# Altium project MK2_PD.PrjPcb
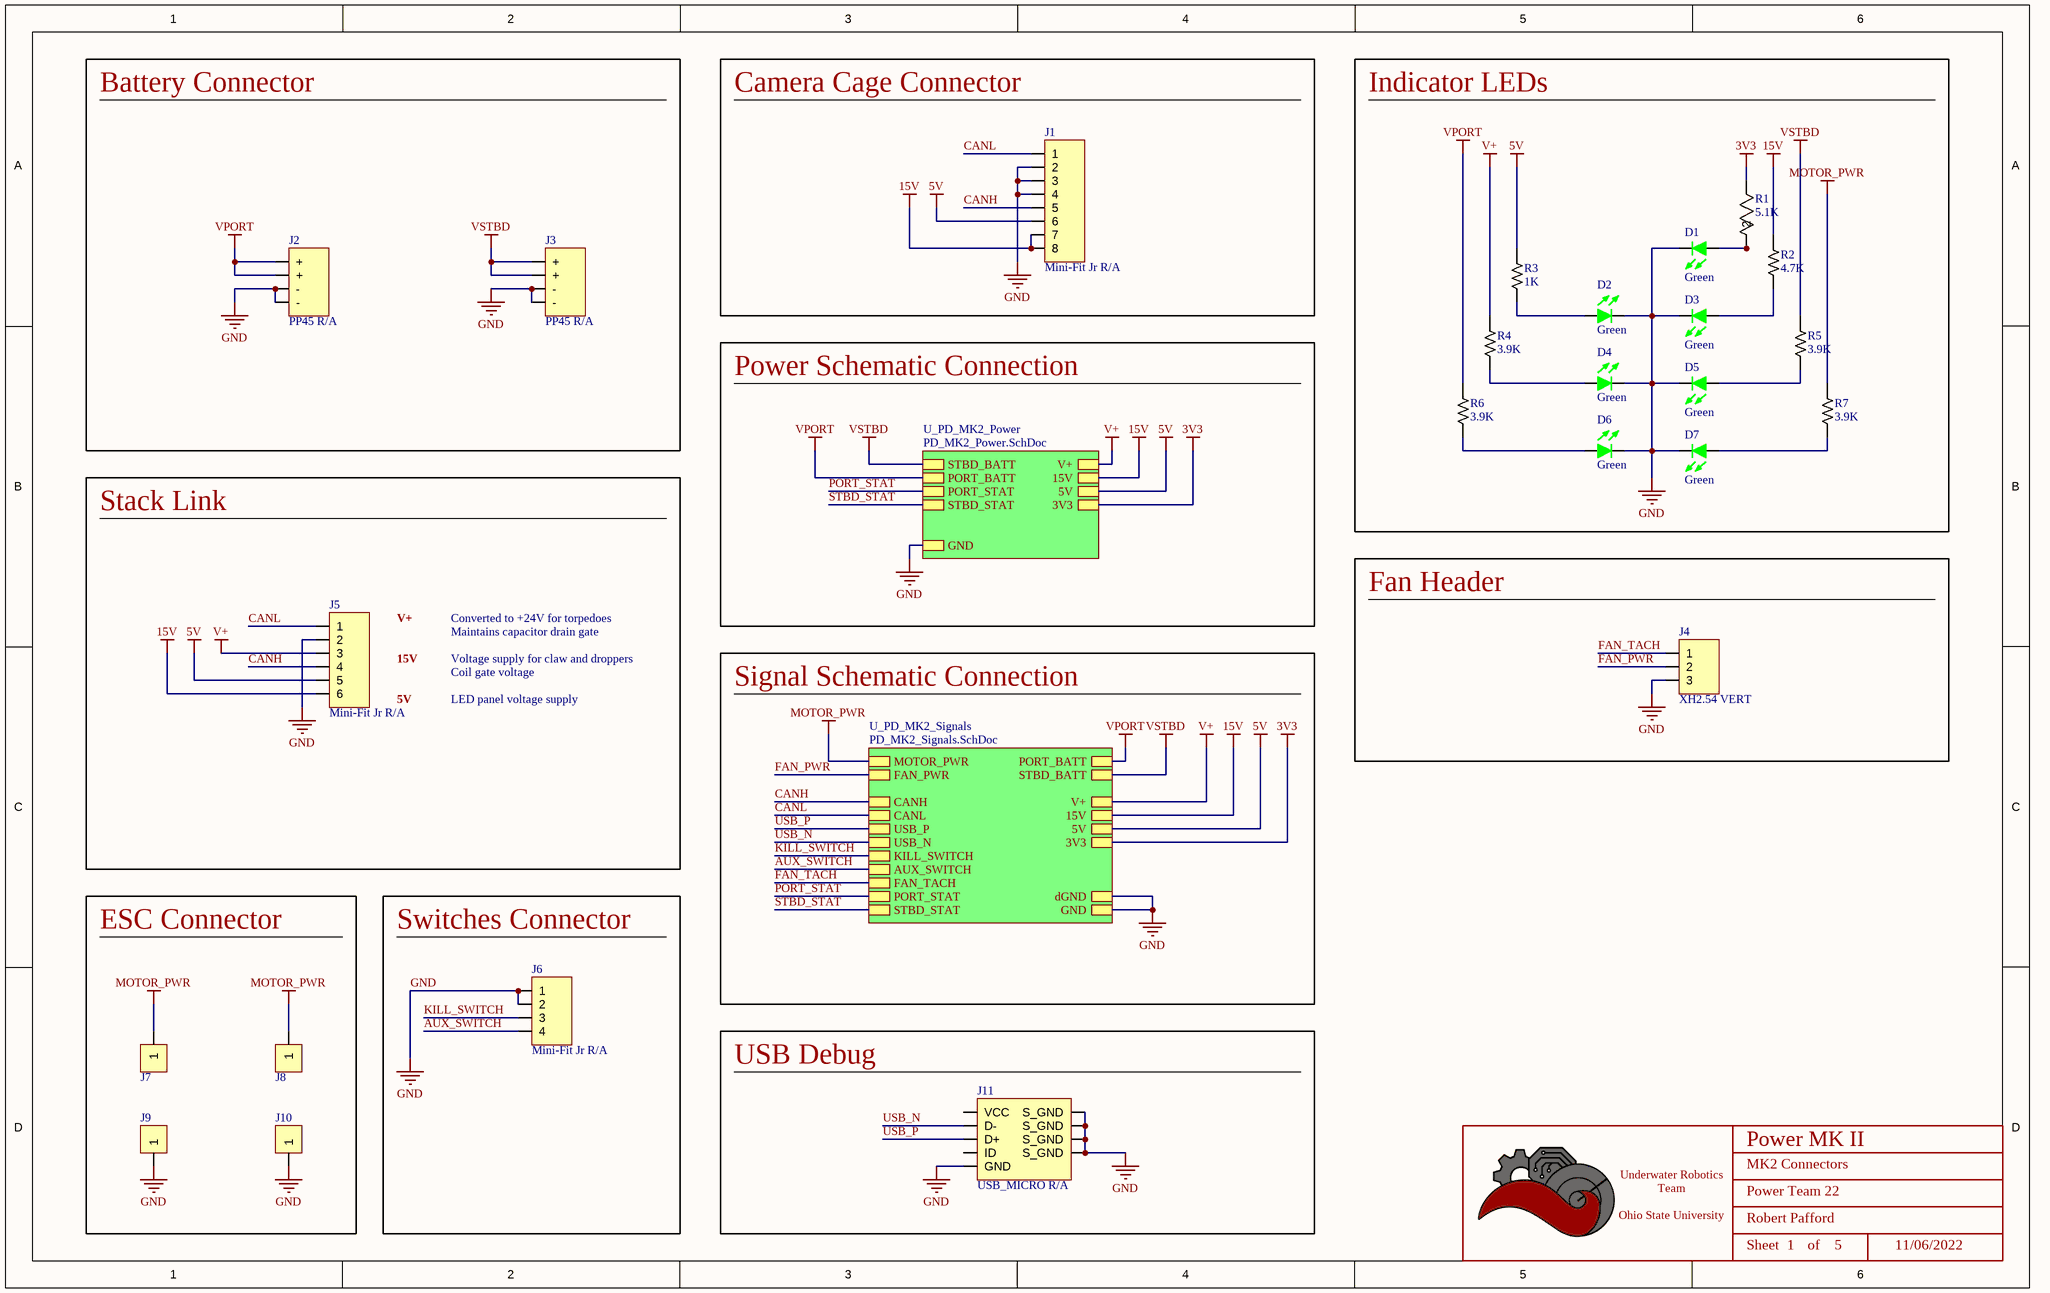
[diagram p0: PD_MK2_Connectors.SchDoc]
BoardRevision: 1.1; DateOfDesignReview: 01/08/2022; ProjectTitle: Power MK II; TeamLead: Robert Pafford
3 sheets, 91 parts. Net scope: strictly hierarchical (ports join the sheet entries above them; power ports are local).
Board file: MK2_PD.PcbDoc
Sheets:
  PD_MK2_Connectors.SchDoc
    U_PD_MK2_Power = PD_MK2_Power.SchDoc
    U_PD_MK2_Signals = PD_MK2_Signals.SchDoc

## Sheet PD_MK2_Connectors.SchDoc: MK2 Connectors
size B; Date: 11/06/2022; Author: Power Team 22; Organization: ORGANIZATION; Address1: ADDRESS 1; Address2: ADDRESS 2; Address3: ADDRESS 3; Address4: ADDRESS 4; DocumentNumber: 1; Revision: -; SheetNumber: 1; SheetTotal: 5; ENG_APP_DATE: --/--/--; DSN_APP_DATE: --/--/--; CHK_APP_DATE: --/--/--

### Parts
(Parts that share a designator on the sheet are numbered #1, #2 ... from top to bottom, then left to right.)
*#1  Title_Block  [LOGO]  (value not drawn)  (graphical)
D1  Color: Green  [LED_0603]  (hidden comment: IN-S63AT5G)
D2  Color: Green  [LED_0603]  (hidden comment: IN-S63AT5G)
D3  Color: Green  [LED_0603]  (hidden comment: IN-S63AT5G)
D4  Color: Green  [LED_0603]  (hidden comment: IN-S63AT5G)
D5  Color: Green  [LED_0603]  (hidden comment: IN-S63AT5G)
D6  Color: Green  [LED_0603]  (hidden comment: IN-S63AT5G)
D7  Color: Green  [LED_0603]  (hidden comment: IN-S63AT5G)
J1  Mini-Fit Jr R/A  [CONN_MOLEX_MINIFIT JR_8 POS_R/A]
J2  PP45 R/A  [CONN_ANDERSON_PP45_4 POS_R/A]
J3  PP45 R/A  [CONN_ANDERSON_PP45_4 POS_R/A]
J4  XH2.54 VERT  [CONN_JST_XH254_3POS_VERT]
J5  Mini-Fit Jr R/A  [CONN_MOLEX_MINIFIT JR_6 POS_R/A]
J6  Mini-Fit Jr R/A  [CONN_MOLEX_MINIFIT JR_4 POS_R/A]
J7  Redcube M4 Term 85A  [Redcube M4 Term 85A]  (value not drawn)
J8  Redcube M4 Term 85A  [Redcube M4 Term 85A]  (value not drawn)
J9  Redcube M4 Term 85A  [Redcube M4 Term 85A]  (value not drawn)
J10  Redcube M4 Term 85A  [Redcube M4 Term 85A]  (value not drawn)
J11  USB_MICRO R/A  [CONN_MINIUSB]
R1  5.1K  [RC0603N_PAN]
R2  Value  (Ohms): 4.7K  [RESISTOR_0603]  (hidden comment: 4.7k Ohm 5% 1/10W)
R3  Value  (Ohms): 1K  [RESISTOR_0603]  (hidden comment: 1k Ohm 5% 1/8W)
R4  Value  (Ohms): 3.9K  [RESISTOR_0603]  (hidden comment: 3.9k Ohm 5% 1/10W)
R5  Value  (Ohms): 3.9K  [RESISTOR_0603]  (hidden comment: 3.9k Ohm 5% 1/10W)
R6  Value  (Ohms): 3.9K  [RESISTOR_0603]  (hidden comment: 3.9k Ohm 5% 1/10W)
R7  Value  (Ohms): 3.9K  [RESISTOR_0603]  (hidden comment: 3.9k Ohm 5% 1/10W)

### Blocks framed on the sheet
Battery Connector: J2 J3
Camera Cage Connector: J1
Indicator LEDs: D1-D7 R1-R7
Stack Link: J5
Fan Header: J4
ESC Connector: J7-J10
Switches Connector: J6
USB Debug: J11

### Sub-sheets
U_PD_MK2_Power = PD_MK2_Power.SchDoc: STBD_BATT, PORT_BATT, GND, V+, 15V, 5V, 3V3, PORT_STAT, STBD_STAT
U_PD_MK2_Signals = PD_MK2_Signals.SchDoc: CANH, CANL, KILL_SWITCH, MOTOR_PWR, STBD_BATT, PORT_BATT, USB_P, USB_N, GND, V+, 15V, 5V, 3V3, dGND, FAN_PWR, FAN_TACH, AUX_SWITCH, PORT_STAT, STBD_STAT

### Nets
3V3: R1.1 ; sheet U_PD_MK2_Power/3V3, sheet U_PD_MK2_Signals/3V3
5V: J1.6 J5.5 R3.1 ; sheet U_PD_MK2_Power/5V, sheet U_PD_MK2_Signals/5V
15V: J1.7 J1.8 J5.6 R2.1 ; sheet U_PD_MK2_Power/15V, sheet U_PD_MK2_Signals/15V
GND: D1.2 D2.2 D3.2 D4.2 D5.2 D6.2 D7.2 J1.2 J1.3 J1.4 J2.3(-) J2.4(-) J3.3(-) J3.4(-) J4.3 J5.2 J6.1 J6.2 J9.1 J10.1 J11.5(GND) J11.6(S_GND) J11.7(S_GND) J11.8(S_GND) J11.9(S_GND) ; sheet U_PD_MK2_Power/GND, sheet U_PD_MK2_Signals/GND, sheet U_PD_MK2_Signals/dGND
MOTOR_PWR: J7.1 J8.1 R7.1 ; sheet U_PD_MK2_Signals/MOTOR_PWR
V+: J5.3 R4.1 ; sheet U_PD_MK2_Power/V+, sheet U_PD_MK2_Signals/V+
VPORT: J2.1(+) J2.2(+) R6.1 ; sheet U_PD_MK2_Power/PORT_BATT, sheet U_PD_MK2_Signals/PORT_BATT
VSTBD: J3.1(+) J3.2(+) R5.1 ; sheet U_PD_MK2_Power/STBD_BATT, sheet U_PD_MK2_Signals/STBD_BATT
AUX_SWITCH: J6.4 ; sheet U_PD_MK2_Signals/AUX_SWITCH
CANH: J1.5 J5.4 ; sheet U_PD_MK2_Signals/CANH
CANL: J1.1 J5.1 ; sheet U_PD_MK2_Signals/CANL
FAN_PWR: J4.2 ; sheet U_PD_MK2_Signals/FAN_PWR
FAN_TACH: J4.1 ; sheet U_PD_MK2_Signals/FAN_TACH
KILL_SWITCH: J6.3 ; sheet U_PD_MK2_Signals/KILL_SWITCH
PORT_STAT: sheet U_PD_MK2_Power/PORT_STAT, sheet U_PD_MK2_Signals/PORT_STAT
STBD_STAT: sheet U_PD_MK2_Power/STBD_STAT, sheet U_PD_MK2_Signals/STBD_STAT
USB_N: J11.2(D-) ; sheet U_PD_MK2_Signals/USB_N
USB_P: J11.3(D+) ; sheet U_PD_MK2_Signals/USB_P
NetD1_1: D1.1 R1.2
NetD2_1: D2.1 R3.2
NetD3_1: D3.1 R2.2
NetD4_1: D4.1 R4.2
NetD5_1: D5.1 R5.2
NetD6_1: D6.1 R6.2
NetD7_1: D7.1 R7.2

Not connected (* = marked no-connect by the designer): J11 1(VCC) 4(ID)

### Notes on the sheet
- Power Schematic Connection
- V+
- Converted to +24V for torpedoes
- Maintains capacitor drain gate
- 15V
- 5V
- Voltage supply for claw and droppers
- Coil gate voltage
- LED panel voltage supply
- Signal Schematic Connection
- DWG. NO.
- REV.
- SHT.
- THIS DOCUMENT AND THE DATA DISCLOSED HEREIN OR HEREWITH IS THE PROPERTY OF ALTIUM LIMITED AND MAY BE FREELY DISTRIBUTED IN WHOLE. NO RIGHTS ARE RESERVED OR EXPRESS OR IMPLIED WARANTEE GIVEN.
- REVISION
- DESCRIPTION
- DATE
- APPROVED
- ENG:
- APPROVALS
- PROJECT
- DSN:
- CHK:
- REFERENCE DOCUMENTS
- PROJECT REVISION:
- TITLE
- DOCUMENT REVISION:
- DESIGN ITEM:
- BOM:
- FAB DWG:
- PCB DWG:
- ASSY DWG:
- SCALE:
- SIZE
- B
- CAGE CODE
- FILE NAME
- DWG NO.
- SHEET
- OF
- REV
- (in symbol Title_Block) Underwater Robotics Team / Ohio State University; Sheet; of

### Library data of the parts
*#1 = Title_Block: UWRT Schematic Title Block Template / Created June 2021, Dylan Trainor
D1-D7 = LED_Green_0603_3V: LED Green Vf= 3V If = 0.005A / IN-S63AT5G; Made By: Robert Pafford; Forward Current: 5mA; ComponentLink1Description: Datasheet; ComponentLink1URL: https://www.we-online.de/katalog/datasheet/150060GS75000.pdf; Forward Voltage: 3V; Package: 0603; Supplier 1: Digi-Key; Supplier Part Number 1: 1830-1062-1-ND
J1 = CONN_MOLEX_MINIFIT JR_8POS_R/A: Molex Minifit Jr. 5569 / 8 Pos R/A Natural; Pitch: 4.2mm; Configuration: Right Angle; Current Per Pin: 13A; Number of Positions: 8; Manufacturer: Molex; Color: Natural; Created By: Flip B; ComponentLink1Description: Datasheet; ComponentLink1URL: https://www.molex.com/pdm_docs/ps/PS-5556-001.pdf; Series: Minifit Jr 5569; Supplier 1: Digi-Key; Supplier Part Number 1: WM1354-ND
J2 J3 = CONN_ANDERSON_2x2_R/A: Anderson PP45 / 4 Pos R/A Red/Black; Pitch: 7.9mm; Configuration: Right Angle; Current Per Pin: 45A; Number of Positions: 4; Manufacturer: Anderson; Color: Red/Black; Created By: Flip B; ComponentLink1Description: Datasheet; ComponentLink1URL: https://www.andersonpower.com/content/dam/app/ecommerce/product-pdfs/DS-PP1545.pdf; Series: PowerPole 45; Supplier 1: Digi-Key; Supplier Part Number 1: 2243-1337G1-ND; Supplier 2: Digi-Key; Supplier Part Number 2: 2243-1336G1-ND; Supplier 3: Digi-Key; Supplier Part Number 3: 2243-1327-BK-ND; Supplier 4: Digi-Key; Supplier Part Number 4: A102007-ND
J4 = CONN_JST_XH254_3POS_VERT: JST XH 2.54mm Pitch 3 Pos Vertical; Current Per Pin: 4A; Number of Positions: 3; NOTE: Do not use JST 2.5mm parts with this footprint. JST does not make 2.54mm pitch pins, rather only clones make this connector!; Manufacturer: JST; Pitch: 2.54mm; Configuration: Vertical; Color: White; Created By: Robert P; Series: XH 2.54; ComponentLink1Description: Purchase Link; ComponentLink1URL: https://www.amazon.com/460PCS-XH2-54-Connector-Terminal-Connectors/dp/B09DBGVX5C
J5 = CONN_MOLEX_MINIFIT JR_6POS_R/A: Molex Minifit Jr. 5569 / 6 Pos R/A Natural; Pitch: 4.2mm; Configuration: Right Angle; Current Per Pin: 13A; Number of Positions: 8; Manufacturer: Molex; Color: Natural; Created By: Flip B; ComponentLink1Description: Datasheet; ComponentLink1URL: https://www.molex.com/pdm_docs/ps/PS-5556-001.pdf; Series: Minifit Jr 5569; Supplier 1: Digi-Key; Supplier Part Number 1: WM1353-ND
J6 = CONN_MOLEX_MINIFIT JR_4POS_R/A: Molex Minifit Jr. 5569 / 4 Pos R/A Natural; Pitch: 4.2mm; Configuration: Right Angle; Current Per Pin: 13A; Number of Positions: 4; Supplier Part Number 1: WM13112-ND; Supplier 1: Digi-Key; Manufacturer: Molex; Color: Natural; Created By: Flip B; ComponentLink1Description: Datasheet; ComponentLink1URL: https://www.molex.com/pdm_docs/sd/026013115_sd.pdf; Series: Minifit Jr 5569
J11 = CONN_MICROUSB: Amphenol Micro USB-B / USB2.0 5 Pin Right Angle SMD; Pitch: 0.65mm; Current Per Pin: 1.8A; Number of Positions: 5; Manufacturer: Amphenol; Configuration: Right Angle; Color: Silver; Created By: Flip B; ComponentLink1Description: Datasheet; ComponentLink1URL: https://cdn.amphenol-icc.com/media/wysiwyg/files/documentation/datasheet/inputoutput/io_usb_micro.pdf?__cf_chl_jschl_tk__=05693735e19256298f6ef6ca2bb2e65c376a4f56-1625503833-0-Abitsb0-ufjOXJYs_S3J3r2iTn-nObalbmXUksF1VvO_h_WEmRdMlUD1I8-hmWSEVWzY1pirKnrPZWfgY3851qyBZe5ZvnNQePLGIzUgdEIQBVUyW36RsbYpDLEWxJ4horD-5gChFgobLYqwmG5aHl0E8lIn_twwPPrOxilK2gP0q9t_CNOs_u5fMqXvXUrlsOv8tIE2NRlu6NVP8qtkL2GjhlkeTUbDMF8WvvpPDTFOgvZ4Y16Ej8F8AhWos88mo5B1HssXozw0XrkJQIqERITUu6rqloz9kf4ZzhBHtDAt-IkiAFY_Ds9SW8FYKKTtINJVpHZQ6Gyu1FFM4Dc9MO0maE8_mmNcwlxqyRoRk_MPWW8VyByXWM5RSp52jteRKw7FeI9WIYvCbPAOy0Eyib-aseIQsnGbglBcUY6_2xp8GYaJM38H3dNvBPsSOfJBPndKedwKHllxjkucXn6xsN0sDXkpGN-cu8_2bDTJ0g-uUucKSCooYX-ApSDNGpkA_p9zv1SOAD8c0zaZVmtiBsN75QpVz2rzq9_BFxOywPvR; Series: 10118192; Supplier 1: Digi-Key; Supplier Part Number 1: 609-4613-1-ND
R1 = ERA-3AEB512V_2: 5.1 kOhms ±0.1% 0.1W, 1/10W Chip Resistor 0603 (1608 Metric) Automotive AEC-Q200 Thin Film; Mfr_Name: Panasonic; Copyright: Copyright (C) 2023 Ultra Librarian. All rights reserved.; Manufacturer_Part_Number: ERA-3AEB512V_2; RefDes: RefDes; Type: DEV
R2 = RESISTOR_4.7K_0603: RES 4.7k OHM 5% 1/10W 0603; Tolerance: +/- 5%; Made By: Robert Pafford; Wattage: 1/10W; Supplier: Digikey; Digikey Part Numer: CR0603-JW-104ELFTR-ND; Supplier 1: Digi-Key; Supplier Part Number 1: RMCF0603JT4K70CT-ND
R3 = RESISTOR_1K_0603: RES 1k OHM 5% 1/8W 0603; Tolerance: +/- 5%; Made By: Robert Pafford; ComponentLink1Description: Datasheet; ComponentLink1URL: https://www.bourns.com/docs/product-datasheets/CRxxxxx.pdf; Wattage: 1/8W; Supplier: Digikey; Digikey Part Numer: CR0603-JW-104ELFTR-ND; Supplier 1: Digi-Key; Supplier Part Number 1: 2019-RK73B1JTTD102JCT-ND
R4-R7 = RESISTOR_3.9K_0603: RES 3.9k OHM 1% 1/10W 0603; Tolerance: +/- 1%; Made By: Robert Pafford; Wattage: 1/10W; Supplier 1: Digi-Key; Supplier Part Number 1: P3.90KHCT-ND
J7-J10 = Redcube M4 Term 85A: Created By: Nahtan Ayer; Current Rating: 85 A; Screw Size: M4

## Sheet PD_MK2_Power.SchDoc: Power
size B; Date: 11/6/2022; Author: Power Team; Organization: ORGANIZATION; Address1: ADDRESS 1; Address2: ADDRESS 2; Address3: ADDRESS 3; Address4: ADDRESS 4; DocumentNumber: 3; Revision: -; SheetNumber: 3; SheetTotal: 5; ENG_APP_DATE: --/--/--; DSN_APP_DATE: --/--/--; CHK_APP_DATE: --/--/--
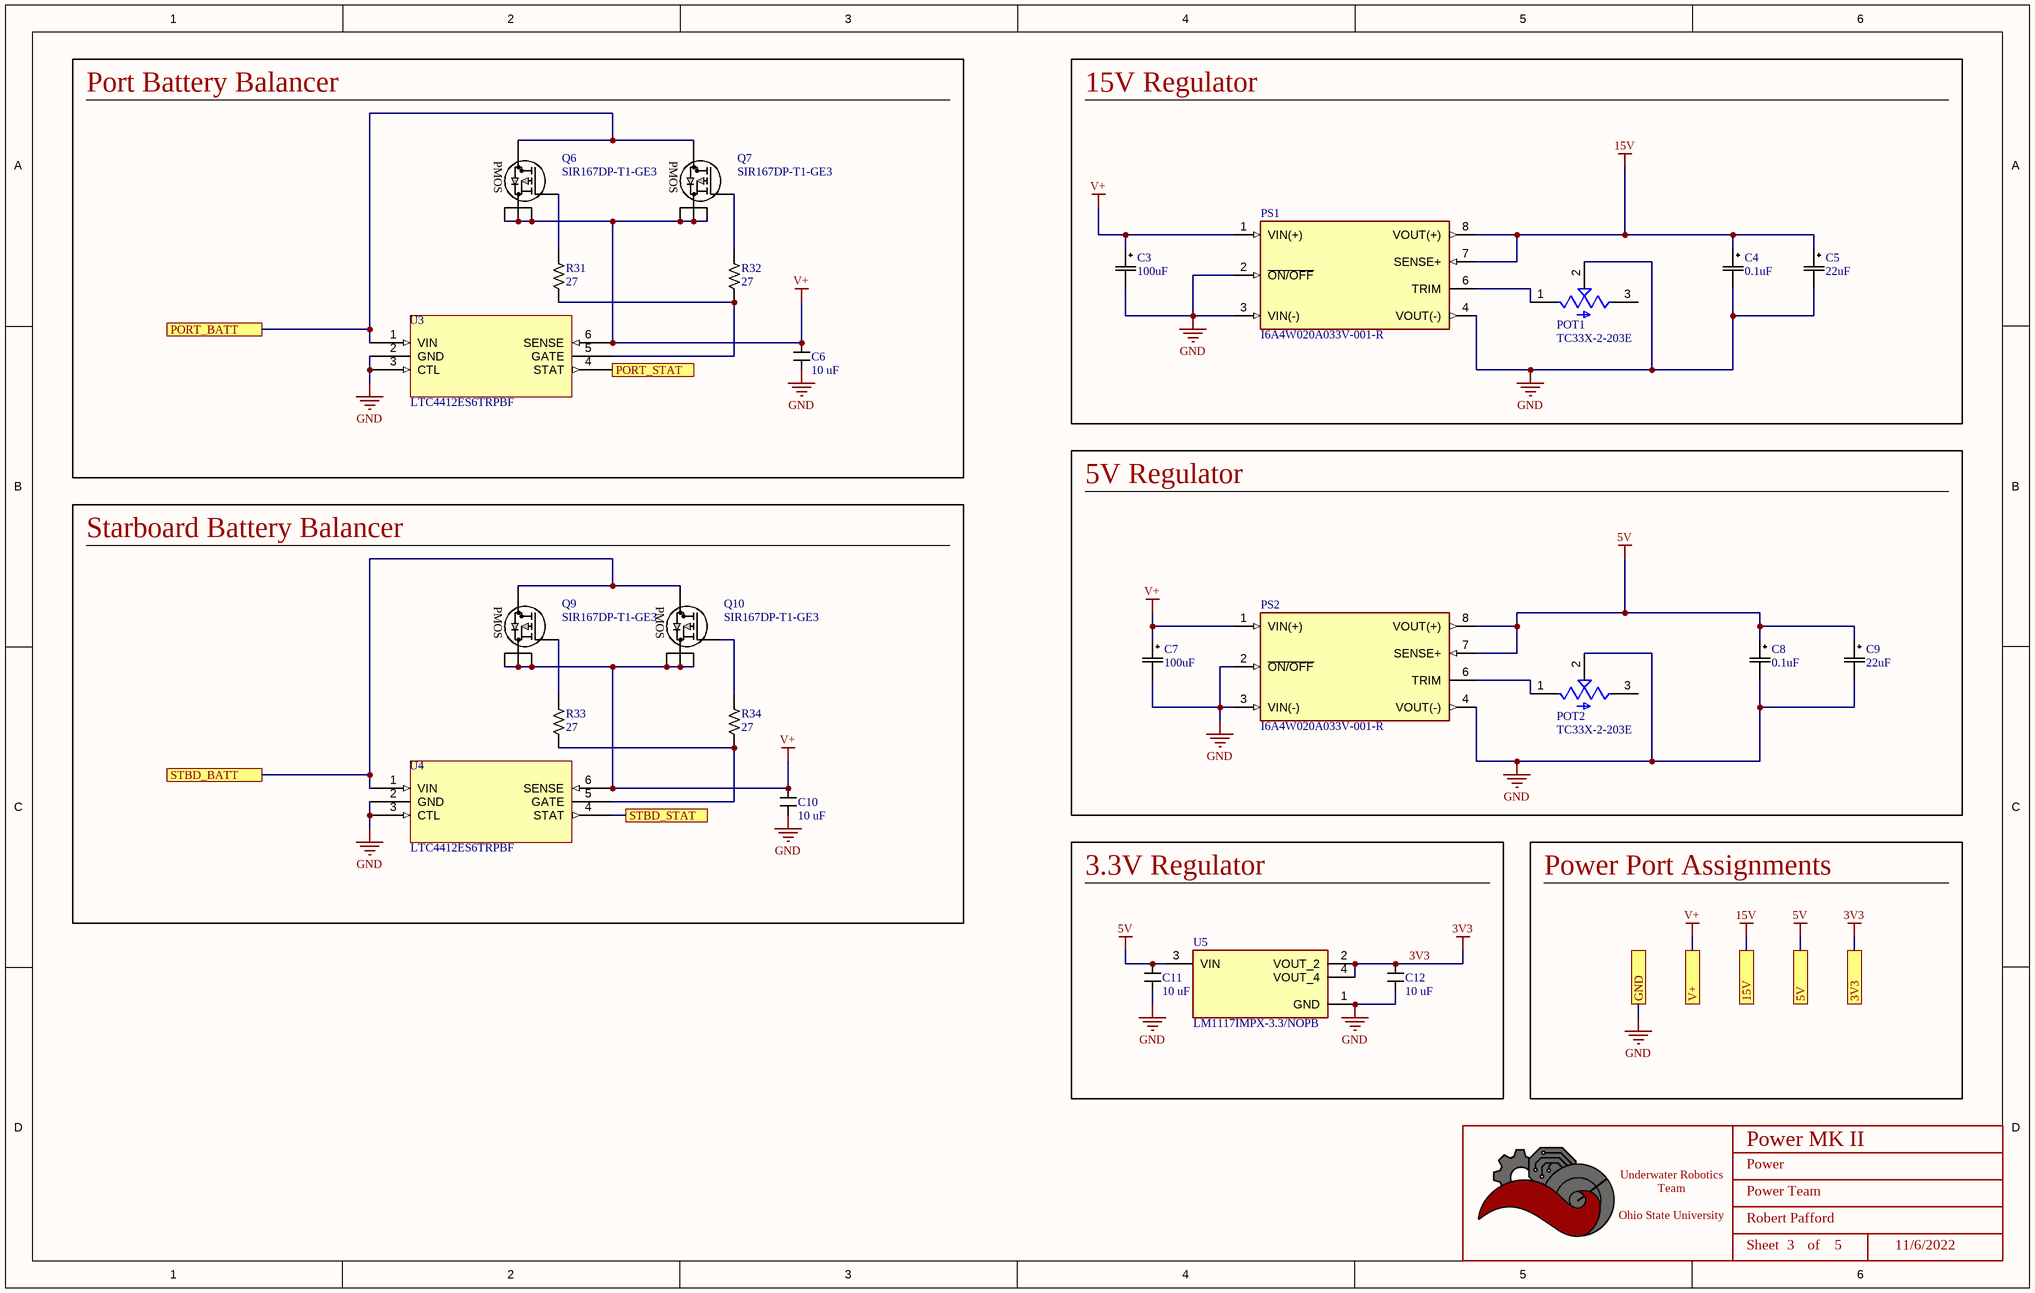
[diagram p1: PD_MK2_Power.SchDoc]

### Parts
(Parts that share a designator on the sheet are numbered #1, #2 ... from top to bottom, then left to right.)
*#2  Title_Block  [LOGO]  (value not drawn)  (graphical)
C3  value 100uF  [PCAP_8x5.4-ELECT_NCA]  (hidden comment: 100uF electrolytic 35 V)
C4  value 0.1uF  [U2-D_NCH]  (hidden comment: 0.1uF electrolytic 35 V)
C5  value 22uF  [PCAP_8x5.4-ELECT_NCA]  (hidden comment: 22uF electrolytic 35 V)
C6  Value (uF): 10 uF  [CAPACITOR_1206]  (hidden comment: 10uF Ceramic 25V)
C7  value 100uF  [PCAP_8x5.4-ELECT_NCA]  (hidden comment: 100uF electrolytic 35 V)
C8  value 0.1uF  [U2-D_NCH]  (hidden comment: 0.1uF electrolytic 35 V)
C9  value 22uF  [PCAP_8x5.4-ELECT_NCA]  (hidden comment: 22uF electrolytic 35 V)
C10  Value (uF): 10 uF  [CAPACITOR_1206]  (hidden comment: 10uF Ceramic 25V)
C11  Value (uF): 10 uF  [CAPACITOR_0603]  (hidden comment: 10uF Ceramic 6.3V)
C12  Value (uF): 10 uF  [CAPACITOR_0603]  (hidden comment: 10uF Ceramic 6.3V)
POT1  TC33X-2-203E  [TRIM_TC33X-2-203E]
POT2  TC33X-2-203E  [TRIM_TC33X-2-203E]
PS1  I6A4W020A033V-001-R  [CONV_I6A4W020A033V-001-R]
PS2  I6A4W020A033V-001-R  [CONV_I6A4W020A033V-001-R]
Q6  SIR167DP-T1-GE3  [MOSFET_7DP-T1-GE3_VIS]
Q7  SIR167DP-T1-GE3  [MOSFET_7DP-T1-GE3_VIS]
Q9  SIR167DP-T1-GE3  [MOSFET_7DP-T1-GE3_VIS]
Q10  SIR167DP-T1-GE3  [MOSFET_7DP-T1-GE3_VIS]
R31  Value  (Ohms): 27  [RESISTOR_0603]  (hidden comment: 27 Ohm 5% 1/8W)
R32  Value  (Ohms): 27  [RESISTOR_0603]  (hidden comment: 27 Ohm 5% 1/8W)
R33  Value  (Ohms): 27  [RESISTOR_0603]  (hidden comment: 27 Ohm 5% 1/8W)
R34  Value  (Ohms): 27  [RESISTOR_0603]  (hidden comment: 27 Ohm 5% 1/8W)
U3  LTC4412ES6TRPBF  [TSOT-23_S6]
U4  LTC4412ES6TRPBF  [TSOT-23_S6]
U5  LM1117IMPX-3.3/NOPB  [SOT-223-4]

### Blocks framed on the sheet
Port Battery Balancer: C6 Q6 Q7 R31 R32 U3
15V Regulator: C3-C5 POT1 PS1
5V Regulator: C7-C9 POT2 PS2
Starboard Battery Balancer: C10 Q9 Q10 R33 R34 U4
3.3V Regulator: C11 C12 U5

### Ports
3V3, 5V, 15V, GND, PORT_BATT, PORT_STAT, STBD_BATT, STBD_STAT, V+

### Nets
3V3: C12.1 U5.2(VOUT_2) U5.4(VOUT_4) ; port 3V3
5V: C8.1 C9.1 C11.1 PS2.7(SENSE+) PS2.8(VOUT(+)) U5.3(VIN) ; port 5V
15V: C4.1 C5.1 PS1.7(SENSE+) PS1.8(VOUT(+)) ; port 15V
GND: C3.2 C4.2 C5.2 C6.2 C7.2 C8.2 C9.2 C10.2 C11.2 C12.2 POT1.2(W) POT2.2(W) PS1.2(~{ON/OFF}) PS1.3(VIN(-)) PS1.4(VOUT(-)) PS2.2(~{ON/OFF}) PS2.3(VIN(-)) PS2.4(VOUT(-)) U3.2(GND) U3.3(CTL) U4.2(GND) U4.3(CTL) U5.1(GND) ; port GND
V+: C3.1 C6.1 C7.1 C10.1 PS1.1(VIN(+)) PS2.1(VIN(+)) Q6.1(S) Q6.2(S) Q6.3(S) Q7.1(S) Q7.2(S) Q7.3(S) Q9.1(S) Q9.2(S) Q9.3(S) Q10.1(S) Q10.2(S) Q10.3(S) U3.6(SENSE) U4.6(SENSE) ; port V+
VPORT: Q6.D Q7.D U3.1(VIN) ; port PORT_BATT
VSTBD: Q9.D Q10.D U4.1(VIN) ; port STBD_BATT
PORT_STAT: U3.4(STAT) ; port PORT_STAT
STBD_STAT: U4.4(STAT) ; port STBD_STAT
NetPOT1_1: POT1.1(CCW) PS1.6(TRIM)
NetPOT2_1: POT2.1(CCW) PS2.6(TRIM)
NetQ6_4: Q6.4(G) R31.1
NetQ7_4: Q7.4(G) R32.1
NetQ9_4: Q9.4(G) R33.1
NetQ10_4: Q10.4(G) R34.1
NetR31_2: R31.2 R32.2 U3.5(GATE)
NetR33_2: R33.2 R34.2 U4.5(GATE)

Not connected (* = marked no-connect by the designer): POT1 3(CW); POT2 3(CW)

### Notes on the sheet
- Power Port Assignments
- DWG. NO.
- REV.
- SHT.
- THIS DOCUMENT AND THE DATA DISCLOSED HEREIN OR HEREWITH IS THE PROPERTY OF ALTIUM LIMITED AND MAY BE FREELY DISTRIBUTED IN WHOLE. NO RIGHTS ARE RESERVED OR EXPRESS OR IMPLIED WARANTEE GIVEN.
- REVISION
- DESCRIPTION
- DATE
- APPROVED
- ENG:
- APPROVALS
- PROJECT
- DSN:
- CHK:
- REFERENCE DOCUMENTS
- PROJECT REVISION:
- TITLE
- DOCUMENT REVISION:
- DESIGN ITEM:
- BOM:
- FAB DWG:
- PCB DWG:
- ASSY DWG:
- SCALE:
- SIZE
- B
- CAGE CODE
- FILE NAME
- DWG NO.
- SHEET
- OF
- REV
- (in symbol SIR167DP-T1-GE3) PMOS
- (in symbol Title_Block) Underwater Robotics Team / Ohio State University; Sheet; of

### Library data of the parts
*#2 = Title_Block: as *#1 on sheet PD_MK2_Connectors
C3 C7 = CAP ALUM 100UF 20% 35V SMD: 100 µF 35 V Aluminum Electrolytic Capacitors Radial, Can - SMD 1000 Hrs; Mfr_Name: Nichicon; Manufacturer_Part_Number: UCB1V0R1MCL1GS; Type: DEV; Made by: Tyson Nguyen; Copyright: Copyright (C) 2022 Ultra Librarian. All rights reserved.; RefDes: RefDes; Supplier 1: Newark; Supplier Part Number 1: 85Y4753
C4 C8 = CAP ALUM 0.1UF 20% 35V SMD: 0.1 µF 35 V Aluminum Electrolytic Capacitors Radial, Can - SMD 7000 Hrs @ 105°C; Mfr_Name: Nichicon; Manufacturer_Part_Number: UCB1V0R1MCL1GS; Type: DEV; Made by: Tyson Nguyen; Copyright: Copyright (C) 2022 Ultra Librarian. All rights reserved.; RefDes: RefDes; Supplier 1: Digi-Key; Supplier Part Number 1: 493-9956-1-ND
C5 C9 = CAP ALUM 22UF 20% 35V SMD: 22 µF 35 V Aluminum Electrolytic Capacitors Radial, Can - SMD 1000 Hrs; Made by: Robert Pafford; Voltage: 35V; Supplier 1: Digi-Key; Supplier Part Number 1: PCE3952DKR-ND
C6 C10 = CAPACITOR_10uF_1206: Cap 10uF 25V +/-10% / Ceramic 1206; Made By: Robert Pafford; Tolerance: +/- 10%; Voltage: 25V; Supplier 1: Digi-Key; Supplier Part Number 1: 1276-1804-6-ND
C11 C12 = CAPACITOR_10uF_0603: Cap 10uF 6.3V +/-20% / Ceramic 0603; Made By: Flip B; ComponentLink1Description: Digikey; ComponentLink1URL: https://www.digikey.com/en/products/detail/samsung-electro-mechanics/CL10A106MQ8NNNC/3886777; Supplier 1: Digi-Key; Supplier Part Number 1: 1276-1119-1-ND; Tolerance: +/- 20%; Voltage: 6.3V
POT1 POT2 = TC33X-2-203E: 20 kOhms 0.1W, 1/10W J Lead Surface Mount Trimmer Potentiometer Cermet 1 Turn Top Adjustment; MF: Bourns; Value: *; SnapEDA_Link: https://www.snapeda.com/parts/TC33X-2-203E/Bourns/view-part/312812/?ref=snap; Check_prices: https://www.snapeda.com/parts/TC33X-2-203E/Bourns/view-part/312812/?ref=eda; Digi-Key_Part_Number: TC33X-2-203ECT-ND; Purchase-URL: https://pricing.snapeda.com/search/part/TC33X-2-203E/?ref=eda; Package: 1608 Bourns; MP: TC33X-2-203E
PS1 PS2 = I6A4W020A033V-001-R: Non-Isolated PoL Module DC DC Converter 1 Output 3.3 ~ 15V 20A 9V - 53V Input; MF: TDK-Lambda Americas; Availability: In Stock; Price: None; Package: DIP-8 TDK-Lambda; MP: I6A4W020A033V-001-R; Value: *; SnapEDA_Link: https://www.snapeda.com/parts/I6A4W020A033V-001-R/TDK-Lambda%20Americas%20Inc./view-part/1737324/?ref=snap; Check_prices: https://www.snapeda.com/parts/I6A4W020A033V-001-R/TDK-Lambda%20Americas%20Inc./view-part/1737324/?ref=eda; Purchase-URL: https://pricing.snapeda.com/search/part/I6A4W020A033V-001-R/?ref=eda
Q6 Q7 Q9 Q10 = SIR167DP-T1-GE3: P-Channel 30 V 60A (Tc) 65.8W (Tc) Surface Mount PowerPAK® SO-8; Mfr_Name: Vishay; Type: DEV; Copyright: Copyright (C) 2022 Ultra Librarian. All rights reserved.; Manufacturer_Part_Number: SIR167DP-T1-GE3; RefDes: RefDes
R31-R34 = RESISTOR_27_0603: RES 27 OHM 5% 1/8W 0603; Tolerance: +/- 5%; Made By: Robert Pafford; ComponentLink1Description: Datasheet; ComponentLink1URL: https://www.bourns.com/docs/product-datasheets/CRxxxxx.pdf; Wattage: 1/8W; Supplier: Digikey; Digikey Part Numer: CR0603-JW-104ELFTR-ND; Supplier 1: Digi-Key; Supplier Part Number 1: 2019-RK73B1JTTD270JCT-ND
U3 U4 = LTC4412ES6TRPBF: OR Controller Source Selector Switch P-Channel 2:1 TSOT-23-6; MP: LTC4412ES6#TRPBF; MF: Analog Devices; Price: None; Availability: Good; Mouser-Purchase-URL: https://snapeda.com/shop?store=Mouser&id=4343773; Arrow_Europe-Purchase-URL: https://snapeda.com/shop?store=Arrow+Europe&id=4343773; DigiKey-Purchase-URL: https://snapeda.com/shop?store=DigiKey&id=4343773; Package: SOT-23-6 Analog Devices; SnapEDA_Link: https://www.snapeda.com/parts/LTC4412ES6%23TRPBF/Analog%20Devices/view-part/4343773/?ref=snap; Value: *; Check_prices: https://www.snapeda.com/parts/LTC4412ES6%23TRPBF/Analog%20Devices/view-part/4343773/?ref=eda
U5 = LM1117IMPX-3.3/NOPB: 800-mA 15-V linear voltage regulator 4-SOT-223 -40 to 125; MF: Texas Instruments; Texas_Instruments-Purchase-URL: https://snapeda.com/shop?store=Texas+Instruments&id=410186; Price: None; Mouser-Purchase-URL: https://snapeda.com/shop?store=Mouser&id=410186; MP: LM1117IMPX-3.3/NOPB; Value: *; Availability: Good; Package: SOT-223-4 Texas Instruments; Arrow_Electronics-Purchase-URL: https://snapeda.com/shop?store=Arrow+Electronics&id=410186; SnapEDA_Link: https://www.snapeda.com/parts/LM1117IMPX-3.3/NOPB/Texas%20Instruments/view-part/410186/?ref=snap; DigiKey-Purchase-URL: https://snapeda.com/shop?store=DigiKey&id=410186

## Sheet PD_MK2_Signals.SchDoc: Signals
size B; Date: 11/06/2022; Author: Power Team; Organization: ORGANIZATION; Address1: ADDRESS 1; Address2: ADDRESS 2; Address3: ADDRESS 3; Address4: ADDRESS 4; DocumentNumber: 2; Revision: -; SheetNumber: 2; SheetTotal: 5; ENG_APP_DATE: --/--/--; DSN_APP_DATE: --/--/--; CHK_APP_DATE: --/--/--
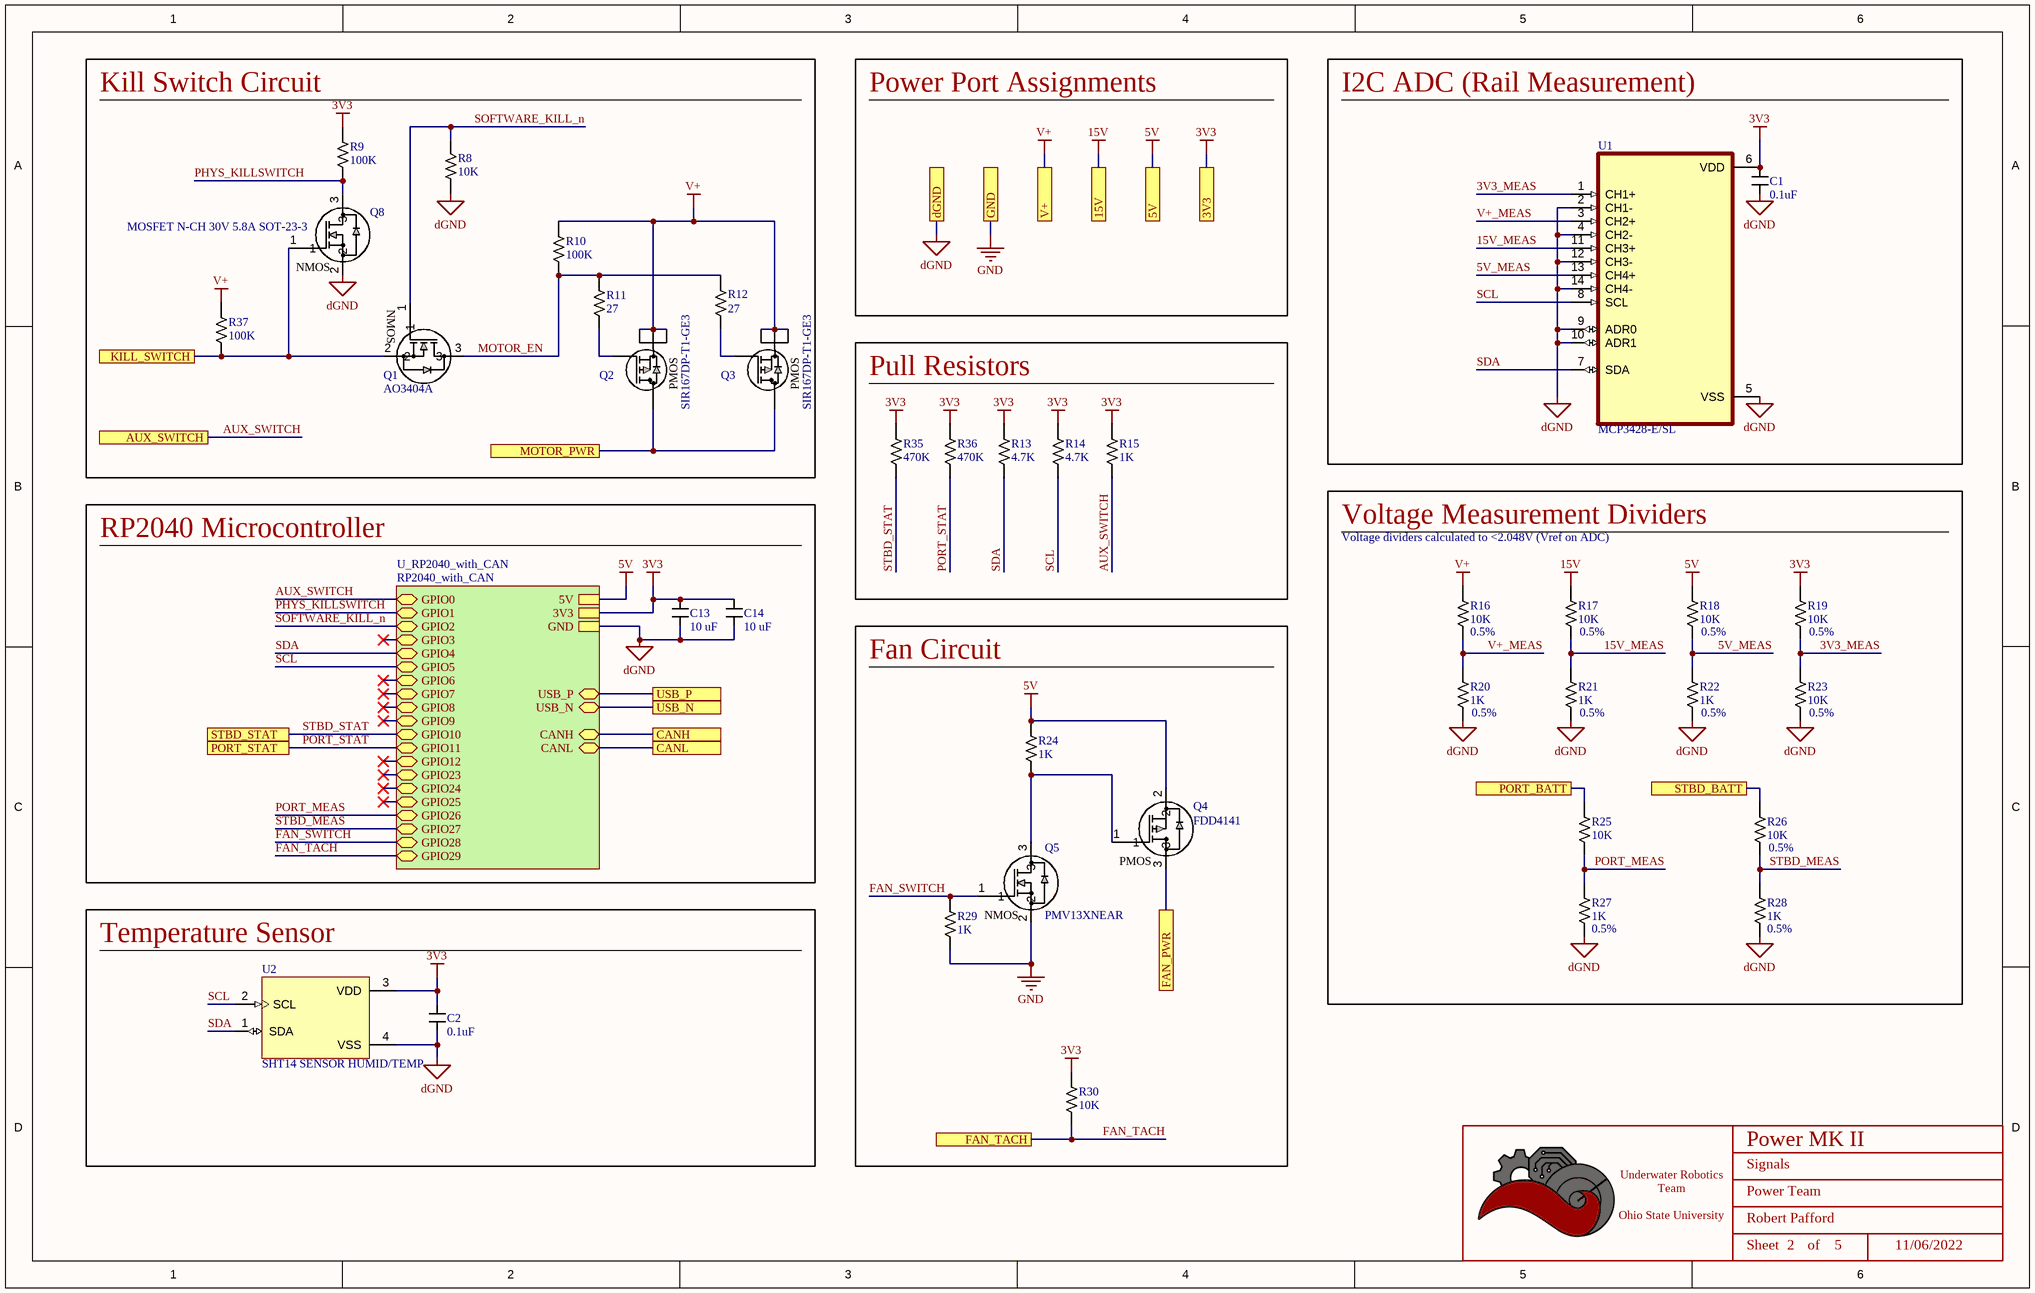
[diagram p2: PD_MK2_Signals.SchDoc]

### Parts
(Parts that share a designator on the sheet are numbered #1, #2 ... from top to bottom, then left to right.)
*#3  Title_Block  [LOGO]  (value not drawn)  (graphical)
C1  value 0.1uF  [CAPACITOR_0603]  (hidden comment: 100nF Ceramic 6.3V)
C2  value 0.1uF  [CAPACITOR_0603]  (hidden comment: 100nF Ceramic 6.3V)
C13  Value (uF): 10 uF  [CAPACITOR_0603]  (hidden comment: 10uF Ceramic 6.3V)
C14  Value (uF): 10 uF  [CAPACITOR_0603]  (hidden comment: 10uF Ceramic 6.3V)
Q1  AO3404A  [SOT-23-3]
Q2  SIR167DP-T1-GE3  [MOSFET_7DP-T1-GE3_VIS]
Q3  SIR167DP-T1-GE3  [MOSFET_7DP-T1-GE3_VIS]
Q4  FDD4141  [DPAK_ONS]
Q5  PMV13XNEAR  [SOT-23-3]
Q8  MOSFET N-CH 30V 5.8A SOT-23-3  [SOT-23-3]
R8  Value  (Ohms): 10K  [RESISTOR_0603]  (hidden comment: 10k Ohm 5% 1/10W)
R9  Value  (Ohms): 100K  [RESISTOR_0603]  (hidden comment: 100k Ohm 0.5% 1/10W)
R10  Value  (Ohms): 100K  [RESISTOR_0603]  (hidden comment: 100k Ohm 0.5% 1/10W)
R11  Value  (Ohms): 27  [RESISTOR_0603]  (hidden comment: 27 Ohm 5% 1/8W)
R12  Value  (Ohms): 27  [RESISTOR_0603]  (hidden comment: 27 Ohm 5% 1/8W)
R13  Value  (Ohms): 4.7K  [RESISTOR_0603]  (hidden comment: 4.7k Ohm 5% 1/10W)
R14  Value  (Ohms): 4.7K  [RESISTOR_0603]  (hidden comment: 4.7k Ohm 5% 1/10W)
R15  Value  (Ohms): 1K  [RESISTOR_0603]  (hidden comment: 1k Ohm 5% 1/8W)
R16  Value  (Ohms): 10K  [RESISTOR_0603]  (hidden comment: 10k Ohm 0.5% 1/10W)
R17  Value  (Ohms): 10K  [RESISTOR_0603]  (hidden comment: 10k Ohm 0.5% 1/10W)
R18  Value  (Ohms): 10K  [RESISTOR_0603]  (hidden comment: 10k Ohm 0.5% 1/10W)
R19  Value  (Ohms): 10K  [RESISTOR_0603]  (hidden comment: 10k Ohm 0.5% 1/10W)
R20  Value  (Ohms): 1K  [RESISTOR_0603]  (hidden comment: 1k Ohm 5% 1/10W)
R21  Value  (Ohms): 1K  [RESISTOR_0603]  (hidden comment: 1k Ohm 5% 1/10W)
R22  Value  (Ohms): 1K  [RESISTOR_0603]  (hidden comment: 1k Ohm 5% 1/10W)
R23  Value  (Ohms): 10K  [RESISTOR_0603]  (hidden comment: 10k Ohm 0.5% 1/10W)
R24  Value  (Ohms): 1K  [RESISTOR_0603]  (hidden comment: 1k Ohm 5% 1/8W)
R25  Value  (Ohms): 10K  [RESISTOR_0603]  (hidden comment: 10k Ohm 0.5% 1/10W)
R26  Value  (Ohms): 10K  [RESISTOR_0603]  (hidden comment: 10k Ohm 0.5% 1/10W)
R27  Value  (Ohms): 1K  [RESISTOR_0603]  (hidden comment: 1k Ohm 5% 1/10W)
R28  Value  (Ohms): 1K  [RESISTOR_0603]  (hidden comment: 1k Ohm 5% 1/10W)
R29  Value  (Ohms): 1K  [RESISTOR_0603]  (hidden comment: 1k Ohm 5% 1/8W)
R30  Value  (Ohms): 10K  [RESISTOR_0603]  (hidden comment: 10k Ohm 5% 1/10W)
R35  Value  (Ohms): 470K  [RESISTOR_0603]  (hidden comment: 470k Ohm 5% 1/10W)
R36  Value  (Ohms): 470K  [RESISTOR_0603]  (hidden comment: 470k Ohm 5% 1/10W)
R37  Value  (Ohms): 100K  [RESISTOR_0603]  (hidden comment: 100k Ohm 0.5% 1/10W)
U1  MCP3428-E/SL  [SOIC127P600X175-14N]
U2  SHT14 SENSOR HUMID/TEMP  [XDCR_SHT41-AD1B-R2]

### Blocks framed on the sheet
Kill Switch Circuit: Q1-Q3 Q8 R8-R12 R37
I2C ADC (Rail Measurement): C1 U1
Pull Resistors: R13-R15 R35 R36
Voltage Measurement Dividers: R16-R23 R25-R28
RP2040 Microcontroller: C13 C14
Fan Circuit: Q4 Q5 R24 R29 R30
Temperature Sensor: C2 U2

### Sub-sheets
U_RP2040_with_CAN = RP2040_with_CAN (file not in this document): USB_P (bidir), USB_N (bidir), 5V, CANH (bidir), CANL (bidir), GPIO0 (bidir), GPIO1 (bidir), GPIO2 (bidir), GPIO3 (bidir), GPIO4 (bidir), GPIO5 (bidir), GPIO6 (bidir), GPIO7 (bidir), GPIO8 (bidir), GPIO9 (bidir), GPIO10 (bidir), GPIO11 (bidir), GPIO12 (bidir), GPIO23 (bidir), GPIO24 (bidir), GPIO25 (bidir), GPIO26 (bidir), GPIO27 (bidir), GPIO28 (bidir), GPIO29 (bidir), 3V3, GND

### Ports
3V3, 5V, 15V, AUX_SWITCH, CANH, CANL, dGND, FAN_PWR, FAN_TACH, GND, KILL_SWITCH, MOTOR_PWR, PORT_BATT, PORT_STAT, STBD_BATT, STBD_STAT, USB_N, USB_P, V+

### Nets
3V3: C1.1 C2.1 C13.1 C14.1 R9.1 R13.1 R14.1 R15.1 R19.1 R30.1 R35.1 R36.1 U1.6(VDD) U2.3(VDD) ; port 3V3, sheet U_RP2040_with_CAN/3V3
5V: Q4.2 R18.1 R24.1 ; port 5V, sheet U_RP2040_with_CAN/5V
15V: R17.1 ; port 15V
GND: C1.2 C2.2 C13.2 C14.2 Q5.2 Q8.2 R8.1 R20.2 R21.2 R22.2 R23.2 R27.2 R28.2 R29.2 U1.2(CH1-) U1.4(CH2-) U1.5(VSS) U1.9(ADR0) U1.10(ADR1) U1.12(CH3-) U1.14(CH4-) U2.4(VSS) ; port GND, port dGND, sheet U_RP2040_with_CAN/GND  [also labelled dGND]
MOTOR_PWR: Q2.D Q3.D ; port MOTOR_PWR
V+: Q2.1(S) Q2.2(S) Q2.3(S) Q3.1(S) Q3.2(S) Q3.3(S) R10.1 R16.1 R37.1 ; port V+
VPORT: R25.1 ; port PORT_BATT
VSTBD: R26.1 ; port STBD_BATT
3V3_MEAS: R19.2 R23.1 U1.1(CH1+)
5V_MEAS: R18.2 R22.1 U1.13(CH4+)
15V_MEAS: R17.2 R21.1 U1.11(CH3+)
AUX_SWITCH: R15.2 ; port AUX_SWITCH, sheet U_RP2040_with_CAN/GPIO0
CANH: port CANH, sheet U_RP2040_with_CAN/CANH
CANL: port CANL, sheet U_RP2040_with_CAN/CANL
FAN_PWR: Q4.3 ; port FAN_PWR
FAN_SWITCH: Q5.1 R29.1 ; sheet U_RP2040_with_CAN/GPIO28
FAN_TACH: R30.2 ; port FAN_TACH, sheet U_RP2040_with_CAN/GPIO29
KILL_SWITCH: Q1.2 Q8.1 R37.2 ; port KILL_SWITCH
MOTOR_EN: Q1.3 R10.2 R11.1 R12.1
PHYS_KILLSWITCH: Q8.3 R9.2 ; sheet U_RP2040_with_CAN/GPIO1
PORT_MEAS: R25.2 R27.1 ; sheet U_RP2040_with_CAN/GPIO26
PORT_STAT: R36.2 ; port PORT_STAT, sheet U_RP2040_with_CAN/GPIO11
SCL: R14.2 U1.8(SCL) U2.2(SCL) ; sheet U_RP2040_with_CAN/GPIO5
SDA: R13.2 U1.7(SDA) U2.1(SDA) ; sheet U_RP2040_with_CAN/GPIO4
SOFTWARE_KILL_n: Q1.1 R8.2 ; sheet U_RP2040_with_CAN/GPIO2
STBD_MEAS: R26.2 R28.1 ; sheet U_RP2040_with_CAN/GPIO27
STBD_STAT: R35.2 ; port STBD_STAT, sheet U_RP2040_with_CAN/GPIO10
USB_N: port USB_N, sheet U_RP2040_with_CAN/USB_N
USB_P: port USB_P, sheet U_RP2040_with_CAN/USB_P
V+_MEAS: R16.2 R20.1 U1.3(CH2+)
NetQ2_4: Q2.4(G) R11.2
NetQ3_4: Q3.4(G) R12.2
NetQ4_1: Q4.1 Q5.3 R24.2

### Notes on the sheet
- Power Port Assignments
- Voltage dividers calculated to <2.048V (Vref on ADC)
- (near R16) 0.5%
- (near R17) 0.5%
- (near R18) 0.5%
- (near R19) 0.5%
- (near R20) 0.5%
- (near R21) 0.5%
- (near R22) 0.5%
- (near R23) 0.5%
- (near R26) 0.5%
- (near R27) 0.5%
- (near R28) 0.5%
- DWG. NO.
- REV.
- SHT.
- THIS DOCUMENT AND THE DATA DISCLOSED HEREIN OR HEREWITH IS THE PROPERTY OF ALTIUM LIMITED AND MAY BE FREELY DISTRIBUTED IN WHOLE. NO RIGHTS ARE RESERVED OR EXPRESS OR IMPLIED WARANTEE GIVEN.
- REVISION
- DESCRIPTION
- DATE
- APPROVED
- ENG:
- APPROVALS
- PROJECT
- DSN:
- CHK:
- REFERENCE DOCUMENTS
- PROJECT REVISION:
- TITLE
- DOCUMENT REVISION:
- DESIGN ITEM:
- BOM:
- FAB DWG:
- PCB DWG:
- ASSY DWG:
- SCALE:
- SIZE
- B
- CAGE CODE
- FILE NAME
- DWG NO.
- SHEET
- OF
- REV
- (in symbol AO3404A) NMOS
- (in symbol FDD4141) PMOS
- (in symbol PMV13XNEAR) NMOS
- (in symbol SIR167DP-T1-GE3) PMOS
- (in symbol Title_Block) Underwater Robotics Team / Ohio State University; Sheet; of

### Library data of the parts
*#3 = Title_Block: as *#1 on sheet PD_MK2_Connectors
C1 C2 = CAPACITOR_0.1uF_0603: Cap 100nF 6.3V +/-10% / Ceramic 0603; Made By: Flip B; ComponentLink1Description: Datsheet; ComponentLink1URL: https://www.mouser.com/datasheet/2/212/KEM_C1002_X7R_SMD-1102033.pdf; Tolerance: +/- 10%; Voltage: 6.3V; Supplier 1: Digi-Key; Supplier Part Number 1: 399-15351-1-ND
C13 C14 = CAPACITOR_10uF_0603: as C11 on sheet PD_MK2_Power; ComponentLink1Description: Digikey; ComponentLink1URL: https://www.digikey.com/en/products/detail/samsung-electro-mechanics/CL10A106MQ8NNNC/3886777; Supplier 1: Digi-Key; Supplier Part Number 1: 1276-1119-1-ND; Tolerance: +/- 20%; Voltage: 6.3V
Q1 = AO3404A: N-Channel 30 V 5.8A (Ta) 1.4W (Ta) Surface Mount SOT-23-3; Vendor: Alpha & Omega Semiconductor Inc.; SourceLibrary: ON_Semiconductor_2020-01-13; Vgs (Max): 3V @ 5.8A, 10V; Vgs (th): 3V @ 250µA; Vdss: 30V; Rds (on): 28mOhm @ 5.8A, 10V; Amp Rating: 5.8 A; FET Type: N-Channel; Package: SOT23-3L; Manufacturer _Part_Number: AO3404A; Power Dissipation: 1.4W (Ta); Supplier 1: Digi-Key; Supplier Part Number 1: 785-1004-1-ND; Created By: Dylan T
Q2 Q3 = SIR167DP-T1-GE3: as Q6 on sheet PD_MK2_Power; Copyright: Copyright (C) 2022 Ultra Librarian. All rights reserved.; Manufacturer_Part_Number: SIR167DP-T1-GE3; RefDes: RefDes
Q4 = FDD4141: P-Channel 10.8A (Ta), 50A (Tc) 2.4W (Ta), 69W (Tc) Surface Mount D-PAK (TO-252AA); FET Type: P-Channel, Power; Vendor: ON Semiconductor; SourceLibrary: ON_Semiconductor_2020-01-13; Vgs (Max): ±20V; Vgs (th): 3V @ 250µA; Vdss: 40 V; Rds (on): 12.3mOhm @ 12.7A, 10V; Amp Rating: 10.8 A; Package: D-PAK (TO-252AA); Manufacturer_Part_Number: FDD4141; Power Dissipation: 2.4W (Ta), 69W (Tc); Supplier 1: Digi-Key; Supplier Part Number 1: FDD4141CT-ND; Created By: Dylan T
Q5 = PMV13XNEAR: N-Channel 20 V 7.3A (Ta) 610mW (Ta), 8.3W (Tc) Surface Mount TO-236AB; Vendor: Nexperia USA Inc.; SourceLibrary: ON_Semiconductor_2020-01-13; Vgs (Max): +/- 12 V; Vgs (th): 1.3V @ 250uA; Vdss: 20 V; Rds (on): 15mOhm @ 7.3A, 8V; Amp Rating: 7.3 A; FET Type: N-Channel; Package: SOT23-3L; Manufacturer _Part_Number: PMV13XNEAR; Power Dissipation: 610mW (Ta), 8.3W (Tc); Created By: Dylan T; Supplier 1: Mouser; Supplier Part Number 1: 771-PMV13XNEAR
Q8 = AO3404A: N-Channel 30 V 5.8A (Ta) 1.4W (Ta) Surface Mount SOT-23-3; Vendor: Alpha & Omega Semiconductor Inc.; SourceLibrary: ON_Semiconductor_2020-01-13; Vgs (Max): 3V @ 5.8A, 10V; Vgs (th): 3V @ 250µA; Rds (on): 28mOhm @ 5.8A, 10V; Amp Rating: 5.8 A; FET Type: N-Channel; Package: SOT23-3L; Manufacturer _Part_Number: AO3404A; Vdss: 30V; Power Dissipation: 1.4W (Ta); Supplier 1: Digi-Key; Supplier Part Number 1: 785-1004-1-ND; Created By: Dylan T
R8 R30 = RESISTOR_10K_0603: RES 10k OHM 5% 1/10W 0603; Tolerance: +/- 5%; Wattage: 1/8W; Made By: Robert Pafford; ComponentLink1Description: Datasheet; ComponentLink1URL: https://www.bourns.com/docs/product-datasheets/CRxxxxx.pdf; Supplier: Digikey; Digikey Part Numer: CR0603-JW-104ELFTR-ND; Supplier 1: Digi-Key; Supplier Part Number 1: 2019-RK73B1JTTD103JCT-ND
R9 R10 R37 = RESISTOR_100K_0.5%_0603: RES 100k OHM 0.5% 1/10W 0603; Tolerance: +/- 0.5%; Made By: John Ulm; ComponentLink1Description: Datasheet; ComponentLink1URL: https://www.bourns.com/docs/product-datasheets/CRxxxxx.pdf; Wattage: 1/10W; Supplier: Digikey; Digikey Part Numer: CR0603-JW-104ELFTR-ND; Supplier 1: Digi-Key; Supplier Part Number 1: 311-2395-1-ND
R11 R12 = RESISTOR_27_0603: as R31 on sheet PD_MK2_Power; ComponentLink1Description: Datasheet; ComponentLink1URL: https://www.bourns.com/docs/product-datasheets/CRxxxxx.pdf; Wattage: 1/8W; Supplier: Digikey; Digikey Part Numer: CR0603-JW-104ELFTR-ND; Supplier 1: Digi-Key; Supplier Part Number 1: 2019-RK73B1JTTD270JCT-ND
R13 R14 = RESISTOR_4.7K_0603: as R2 on sheet PD_MK2_Connectors; Wattage: 1/10W; Supplier: Digikey; Digikey Part Numer: CR0603-JW-104ELFTR-ND; Supplier 1: Digi-Key; Supplier Part Number 1: RMCF0603JT4K70CT-ND
R15 R24 R29 = RESISTOR_1K_0603: as R3 on sheet PD_MK2_Connectors; ComponentLink1Description: Datasheet; ComponentLink1URL: https://www.bourns.com/docs/product-datasheets/CRxxxxx.pdf; Wattage: 1/8W; Supplier: Digikey; Digikey Part Numer: CR0603-JW-104ELFTR-ND; Supplier 1: Digi-Key; Supplier Part Number 1: 2019-RK73B1JTTD102JCT-ND
R16-R19 R23 R25 R26 = RESISTOR_10K_0.5%_0603: RES 10k OHM 0.5% 1/10W 0603; Tolerance: +/- 0.5%; Made By: Robert Pafford; Wattage: 1/10W; Supplier: Digikey; Digikey Part Numer: CR0603-JW-104ELFTR-ND; Supplier 1: Digi-Key; Supplier Part Number 1: 749-1695-1-ND
R20-R22 R27 R28 = RESISTOR_1K_0.5%_0603: RES 1k OHM 0.5% 1/10W 0603; Tolerance: +/- 0.5%; Made By: Robert Pafford; Wattage: 1/10W; Supplier: Digikey; Digikey Part Numer: CR0603-JW-104ELFTR-ND; Supplier 1: Digi-Key; Supplier Part Number 1: 749-1693-1-ND
R35 R36 = RESISTOR_470K_0603: RES 470k OHM 5% 1/10W 0603; Tolerance: +/- 5%; Made By: Robert P; ComponentLink1Description: Datasheet; ComponentLink1URL: https://www.bourns.com/docs/product-datasheets/CRxxxxx.pdf; Wattage: 1/10W; Supplier 1: Digi-Key; Supplier Part Number 1: RMCF0603JT470KCT-ND
U1 = MCP3428-E/SL: 16 Bit Analog to Digital Converter 4 Input 1 Sigma-Delta 14-SOIC; MF: Microchip; Package: SOIC-14 Microchip; SnapEDA_Link: https://www.snapeda.com/parts/MCP3428-E/SL/Microchip/view-part/13249/?ref=snap; MP: MCP3428-E/SL; Price: None; Availability: Unavailable; Value: *
U2 = SHT41-AD1B-R2: Digital Relative Humidity Temperature Sensor, Â±1.8 / max 2.5 %RH, Â±0.2 Â°C, Ultra-Low-Power; MF: Sensirion; Price: None; SnapEDA_Link: https://www.snapeda.com/parts/SHT41-AD1B-R2/Sensirion/view-part/?ref=snap; MP: SHT41-AD1B-R2; Purchase-URL: https://pricing.snapeda.com/search/part/SHT41-AD1B-R2/?ref=eda; Value: *; Availability: In Stock; Package: None; Check_prices: https://www.snapeda.com/parts/SHT41-AD1B-R2/Sensirion/view-part/?ref=eda; Supplier 1: Digi-Key; Supplier Part Number 1: 1649-SHT41-AD1B-R2CT-ND

## Nets that join several sheets
3V3: PD_MK2_Connectors (R1.1), PD_MK2_Power (C12.1 U5.2 U5.4), PD_MK2_Signals (14 pins)
5V: PD_MK2_Connectors (J1.6 J5.5 R3.1), PD_MK2_Power (6 pins), PD_MK2_Signals (Q4.2 R18.1 R24.1)
15V: PD_MK2_Connectors (J1.7 J1.8 J5.6 R2.1), PD_MK2_Power (C4.1 C5.1 PS1.7 PS1.8), PD_MK2_Signals (R17.1)
GND: PD_MK2_Connectors (25 pins), PD_MK2_Power (23 pins), PD_MK2_Signals (22 pins)
MOTOR_PWR: PD_MK2_Connectors (J7.1 J8.1 R7.1), PD_MK2_Signals (Q2.D Q3.D)
V+: PD_MK2_Connectors (J5.3 R4.1), PD_MK2_Power (20 pins), PD_MK2_Signals (9 pins)
VPORT: PD_MK2_Connectors (J2.1 J2.2 R6.1), PD_MK2_Power (Q6.D Q7.D U3.1), PD_MK2_Signals (R25.1)
VSTBD: PD_MK2_Connectors (J3.1 J3.2 R5.1), PD_MK2_Power (Q9.D Q10.D U4.1), PD_MK2_Signals (R26.1)
AUX_SWITCH: PD_MK2_Connectors (J6.4), PD_MK2_Signals (R15.2)
FAN_PWR: PD_MK2_Connectors (J4.2), PD_MK2_Signals (Q4.3)
FAN_TACH: PD_MK2_Connectors (J4.1), PD_MK2_Signals (R30.2)
KILL_SWITCH: PD_MK2_Connectors (J6.3), PD_MK2_Signals (Q1.2 Q8.1 R37.2)
PORT_STAT: PD_MK2_Power (U3.4), PD_MK2_Signals (R36.2)
STBD_STAT: PD_MK2_Power (U4.4), PD_MK2_Signals (R35.2)